# EAGLE design step_down_st1s10 (EAGLE 6.2)
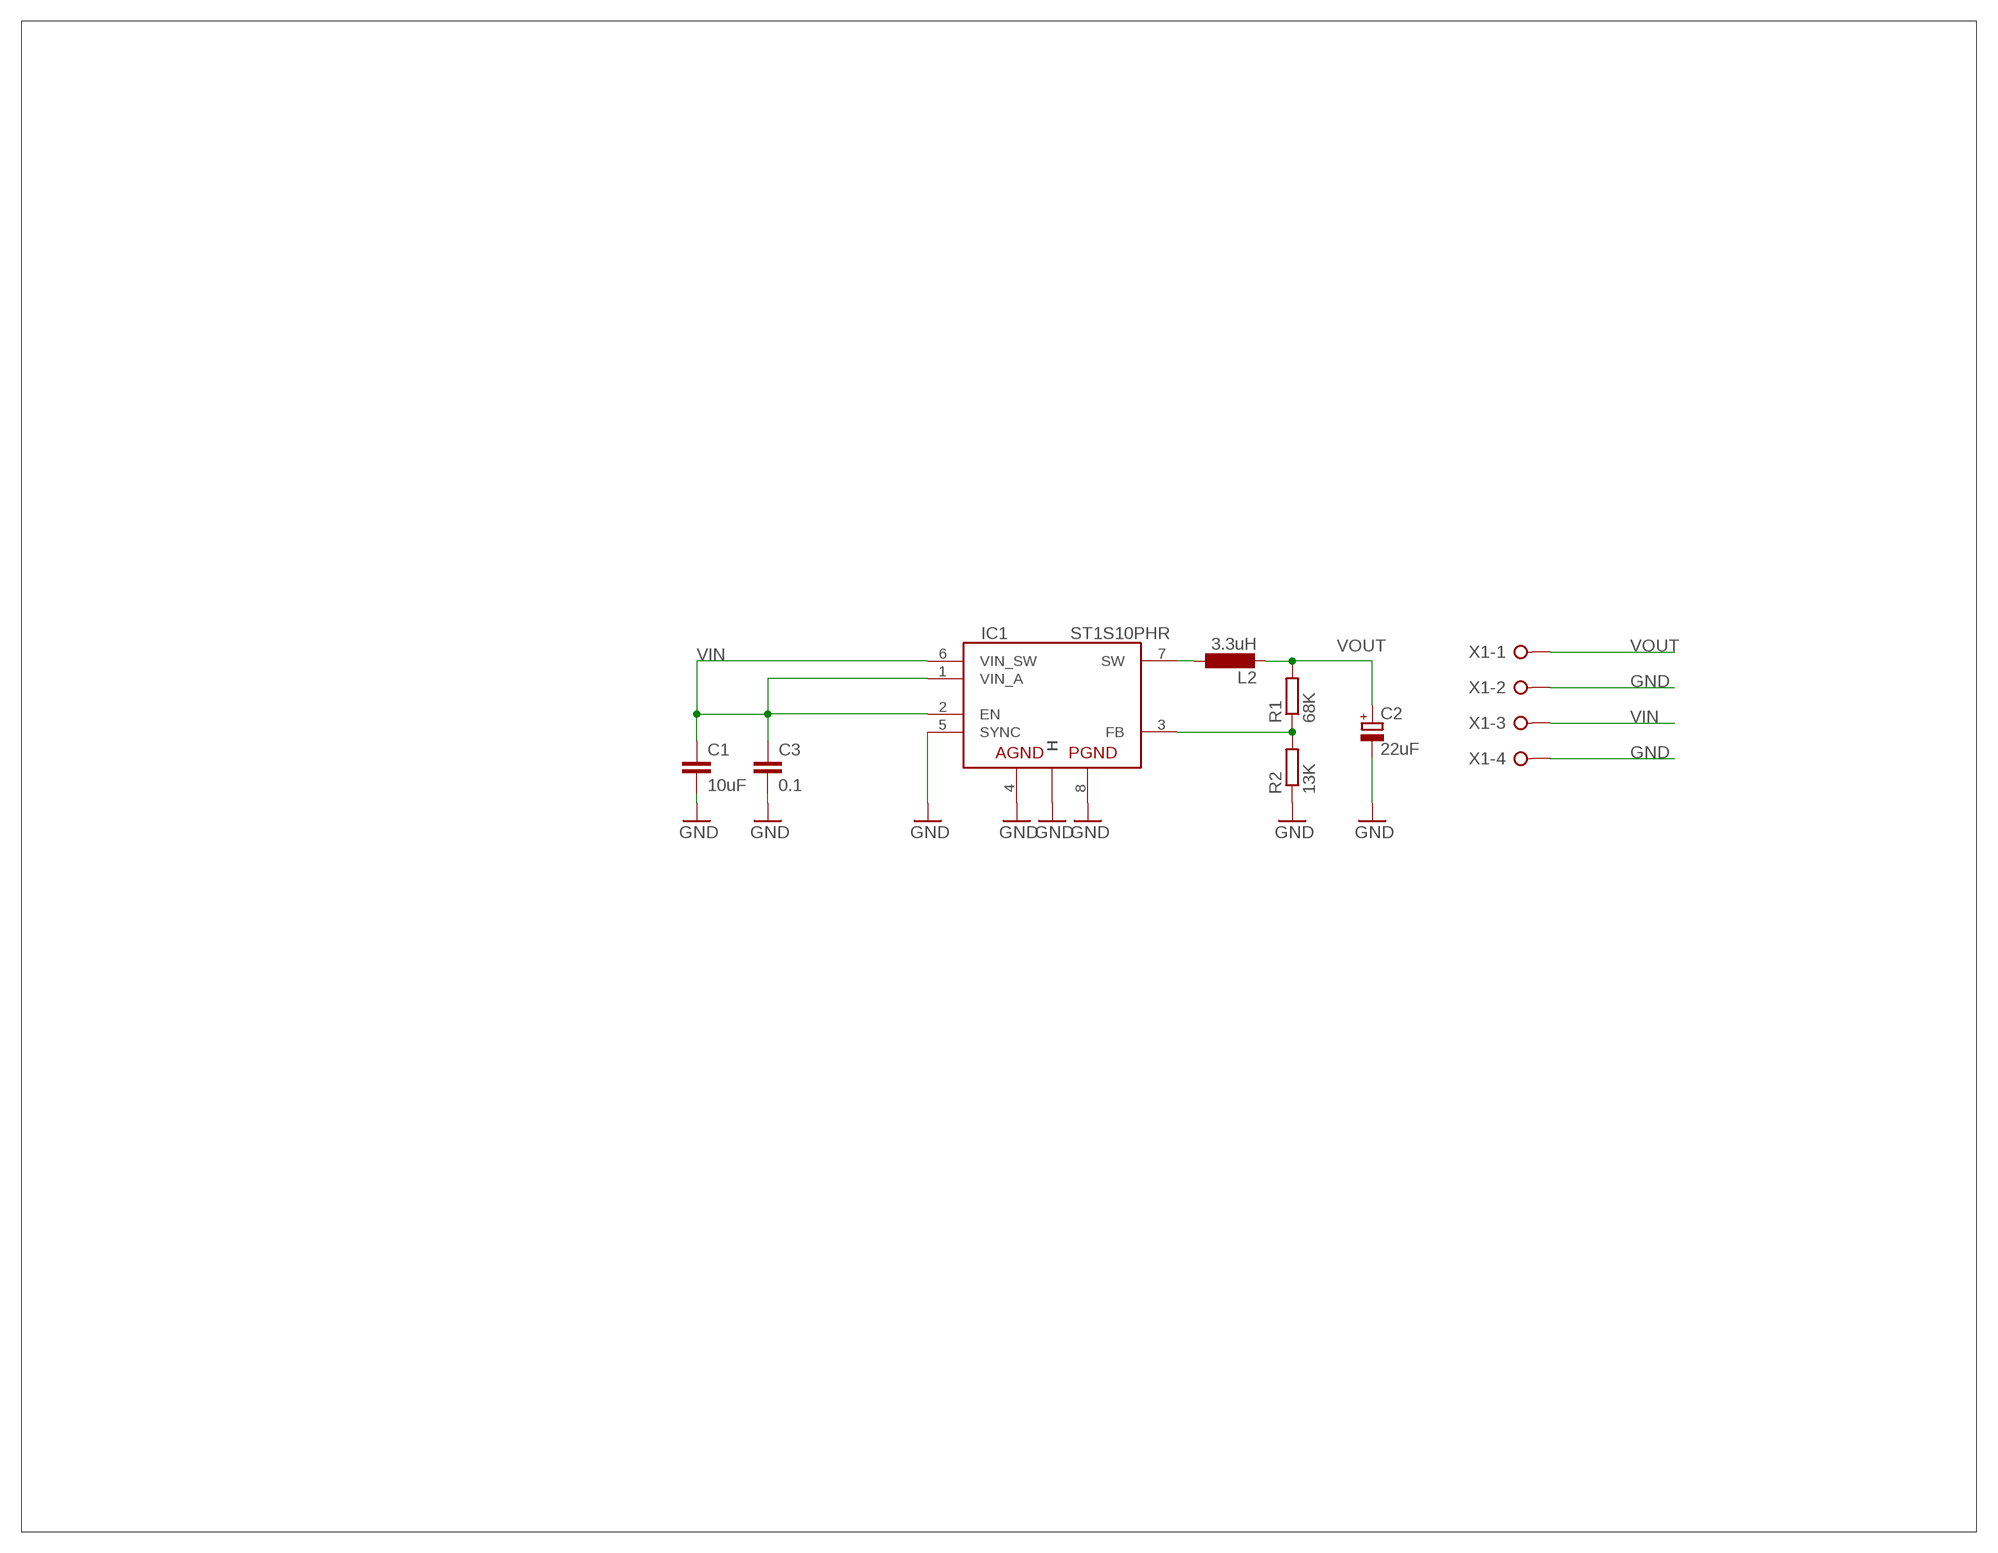
[diagram p0: schematic, sheet 1]

## Parts
C1  10uF  C-EUC1210  [C1210]
C2  22uF  CPOL-EUD/7343-31R  [D/7343-31R]
C3  0.1  C-EUC1210  [C1210]
IC1  ST1S10PHR  [HSOP8]
L2  3.3uH  L-EUPIS2816  [PIS2816]
R1  68K  R-EU_R0805  [R0805]
R2  13K  R-EU_R0805  [R0805]
X1  W237-04P  [W237-4P]

## Nets
GND: C1.2 C2.- C3.2 IC1.4(AGND) IC1.5(SYNC) IC1.8(PGND) IC1.H@1(H) R2.1 X1.2 X1.4
N$2: IC1.3(FB) R1.1 R2.2
N$3: IC1.7(SW) L2.1
VIN: C1.1 C3.1 IC1.1(VIN_A) IC1.2(EN) IC1.6(VIN_SW) X1.3
VOUT: C2.+ L2.2 R1.2 X1.1
Unconnected: IC1.H@2(H) IC1.H@3(H) IC1.H@4(H) IC1.H@5(H) IC1.H@6(H)

## Library data of the parts
C1 C3 = rcl:C-EU: CAPACITOR, European symbol
C2 = rcl:CPOL-EU: POLARIZED CAPACITOR, European symbol
IC1 = vreg-pulse:ST1S10: 3 A, 900 kHz, monolithic synchronous step-down regulator
L2 = rcl:L-EU: INDUCTOR, European symbol
R1 R2 = rcl:R-EU_: RESISTOR, European symbol
X1 = con-wago-508:W237-04P: WAGO SREW CLAMP; OC_FARNELL: unknown; OC_NEWARK: unknown

## Board
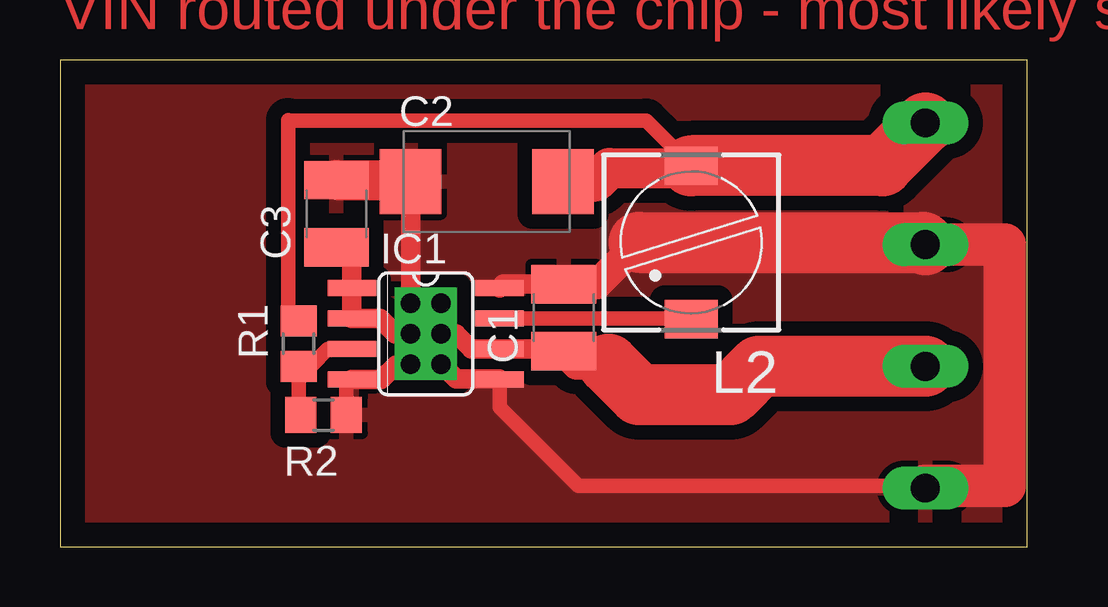
[diagram p1: board, top side]
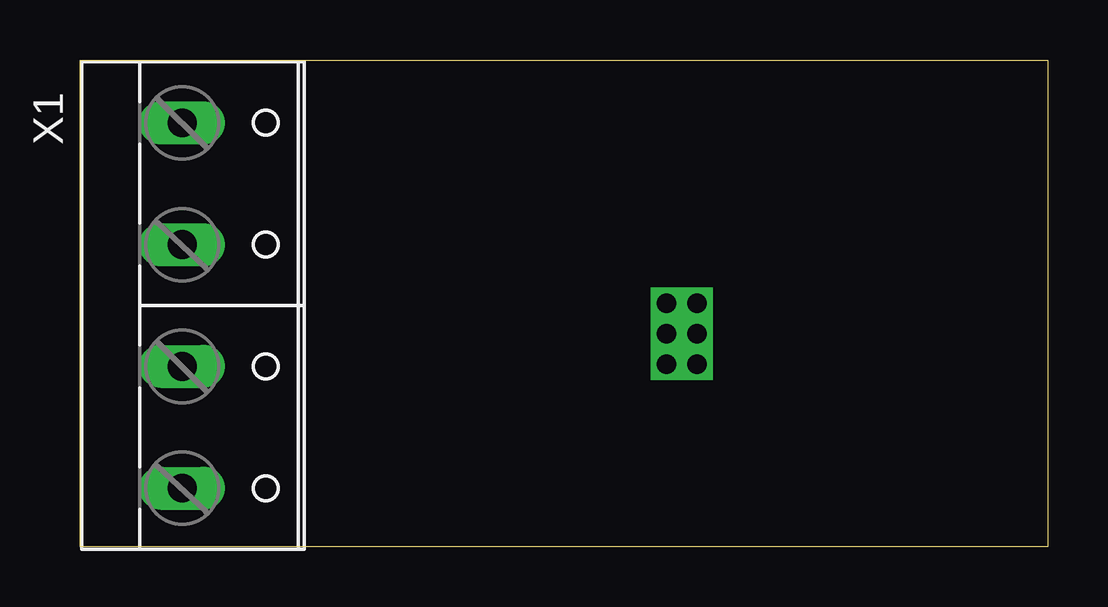
[diagram p2: board, bottom side, seen from below]

Size 40.31 x 20.31 mm. Coordinates in mm from the lower left corner, seen from the top.
Outline: 0,0 40.31,0 40.31,20.31 0,20.31 0,0
Copper layers (1*16): Top 0.035mm / dielectric 1.5mm / Bottom 0.035mm
Design rules: minimum track width 10mil, minimum drill 24mil, track to track 8mil, track to pad 8mil, pad to pad 8mil, via to via 8mil, smd to smd 8mil, copper to edge 40mil, drill to drill 8mil, minimum pad ring 10mil, minimum via ring 8mil, stop-mask expansion 4mil, vias tented up to drill 0mil, thermal gap 10mil

### Footprints (pad centres in the part's own frame; a part is rotated, then mirrored left to right if it is on the bottom)
C1210 = smd 1.6 x 2.7: 1 -1.4,0; 2 1.4,0
D/7343-31R = smd 2.55 x 2.7: + 3.175,0; - -3.175,0
HSOP8 = smd 0.66 x 2.032: 1 -1.905,-3.073; 2 -0.635,-3.073; 3 0.635,-3.073; 4 1.905,-3.073; 5 1.905,3.073; 6 0.635,3.073; 7 -0.635,3.073; 8 -1.905,3.073 | drill 0.8 square: H@1 -1.27,-0.635; H@2 0,-0.635; H@3 1.27,-0.635; H@4 1.27,0.635; H@5 0,0.635; H@6 -1.27,0.635
PIS2816 = smd 2.2 x 1.6: 1 0,3.2; 2 0,-3.2
R0805 = smd 1.3 x 1.5: 1 -0.95,0; 2 0.95,0
W237-4P = drill 1.194 long: 1 -7.62,-0.635; 2 -2.54,-0.635; 3 2.54,-0.635; 4 7.62,-0.635

### Placement (x,y rotation side)
C1  20.99,9.56 90 top
C2  17.78,15.24 0 top
C3  11.52,13.9 90 top
IC1  15.24,8.89 270 top
L2  26.3,12.7 180 top
R1  9.94,8.48 90 top
R2  10.98,5.5 180 top
X1  35.42,10.07 270 bottom

### Tracks (layer width: path | path; a pad name or v marks a point on that pad's centre or on a via)
GND
  Top 0.61: R2.1 11.93,6.75 IC1.4 | IC1.5 18.31,5.82 21.59,2.54 35.97,2.54 X1.4
  Top 0.813: C2.- IC1.H@1 | IC1.8 18.48,10.96 C1.2 | IC1.4 13.38,6.99 14,7.6 15.9,7.6 16.5,7 18.3,7 IC1.5
  Top 1.27: C1.2 22.39,10.96 24.13,12.7
  Top 1.676: C3.2 14.54,15.3 C2.-
  Top 1.778: X1.2 39.37,12.61 39.37,2.54 36.05,2.54 X1.4
  Top 2.54: 24.13,12.7 35.97,12.7 X1.2
  pour Top (isolate 0.61): 0,20.32 40.3,20.32 40.3,0 0,0
N$2
  Top 0.61: IC1.3 11.15,8.26 10.5,7.6 10.01,7.6 R1.1 9.94,5.59 R2.2
N$3
  Top 0.61: IC1.7 26.27,9.53 L2.1
VIN
  Top 0.813: C1.1 20.89,8.26 19.05,8.26 IC1.6 17.14,8.26 16.51,8.89 13.97,8.89 13.34,9.53 IC1.2 IC1.1 12.17,11.85 C3.1
  Top 1.27: 22.86,7.62 21.53,7.62 C1.1
  Top 2.54: X1.3 29.12,7.53 27.94,6.35 24.13,6.35 22.86,7.62
VOUT
  Top 0.61: L2.2 24.42,17.78 9.52,17.78 9.5,17.8 9.5,9.55 9.62,9.43 R1.2
  Top 1.676: C2.+ 22.34,15.24 22.9,15.8 26.2,15.8 L2.2
  Top 2.54: X1.1 34.27,15.9 L2.2

### Text on the board
Top: VIN routed under the chip - most likely should not